# Altium schematic sheet POWER.SchDoc
size A4
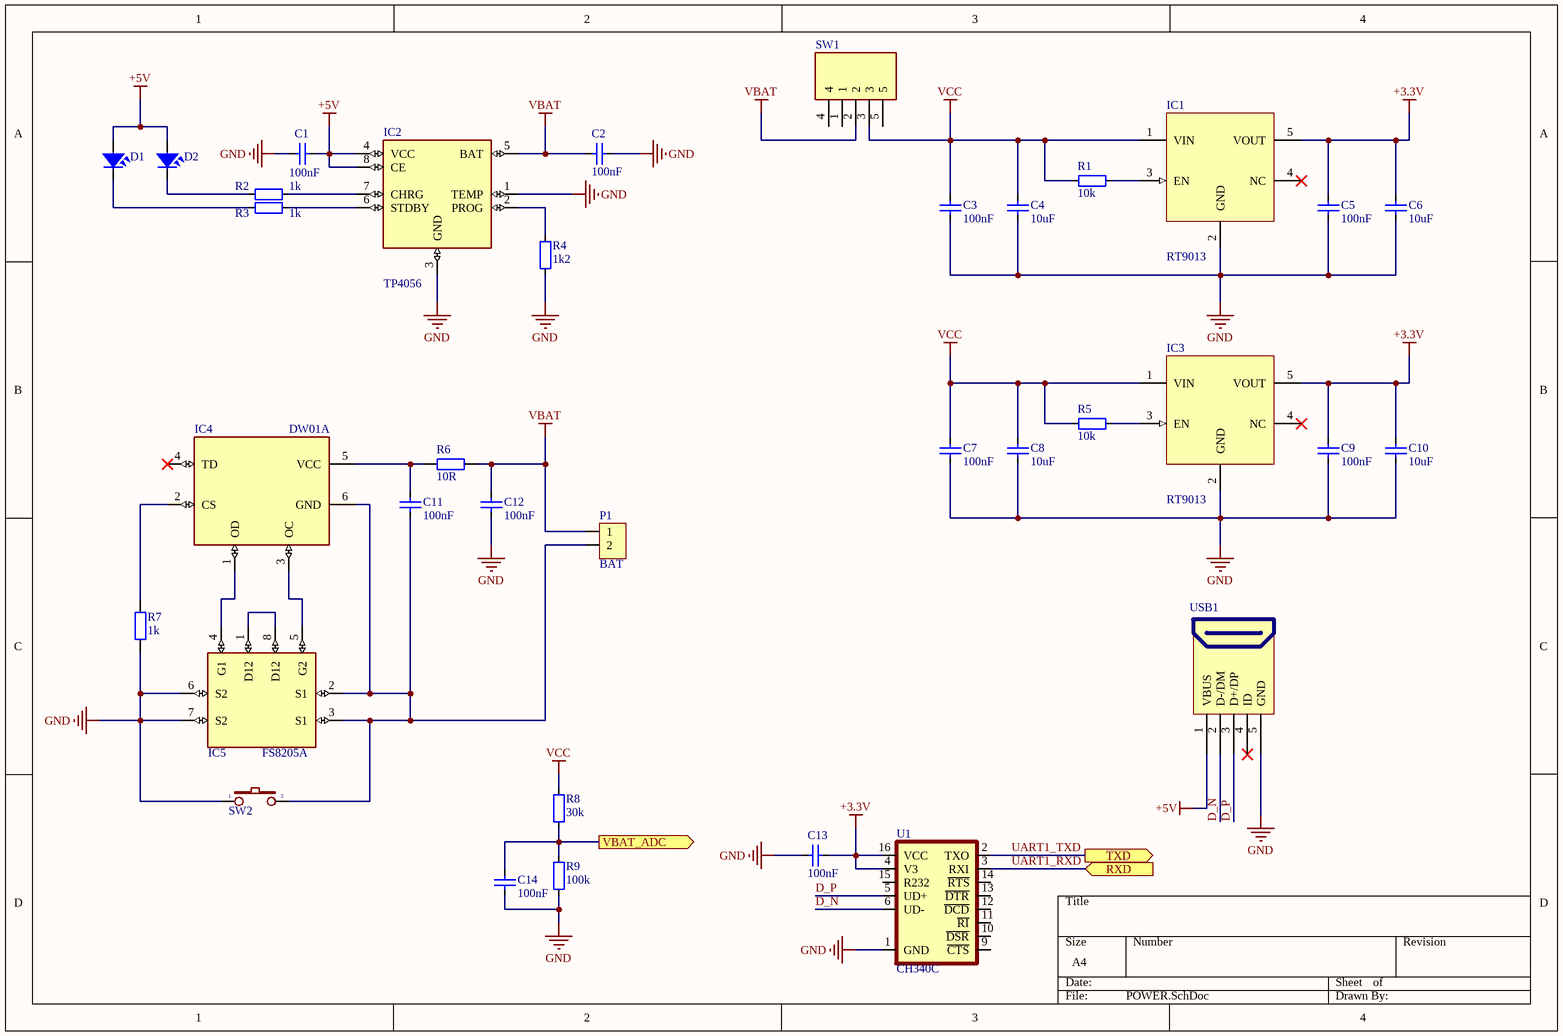
[diagram p0: POWER.SchDoc]

## Parts
C1  100nF  [CAP_0603]
C2  100nF  [CAP_0603]
C3  100nF  [CAP_0603]
C4  10uF  [CAP_0603]
C5  100nF  [CAP_0603]
C6  10uF  [CAP_0603]
C7  100nF  [CAP_0603]
C8  10uF  [CAP_0603]
C9  100nF  [CAP_0603]
C10  10uF  [CAP_0603]
C11  100nF  [CAP_0603]
C12  100nF  [CAP_0603]
C13  100nF  [CAP_0603]
C14  100nF  [CAP_0603]
D1  BLUE  [LED-0603-Green]  (value not drawn)
D2  BLUE  [LED-0603-Green]  (value not drawn)
IC1  RT9013  [SOT23-5]
IC2  TP4056  [TP4056]
IC3  RT9013  [SOT23-5]
IC4  DW01A  [SOT23-6]
IC5  FS8205A  [FS8205A]
P1  BAT  [HEAD2P-1.25]
R1  10k  [RES-SMD-0603]
R2  1k  [RES-SMD-0603]
R3  1k  [RES-SMD-0603]
R4  1k2  [RES-SMD-0603]
R5  10k  [RES-SMD-0603]
R6  10R  [RES-SMD-0603]
R7  1k  [RES-SMD-0603]
R8  30k  [RES-SMD-0603]
R9  100k  [RES-SMD-0603]
SW1  Cong tac gat  [CONG-TAC-GAT]  (value not drawn)
SW2  SW  [SW]  (value not drawn)
U1  CH340C  [SO16]
USB1  USB Micro 5p DIP  [USB Micro 5p DIP]  (value not drawn)

## Ports
RXD (in), TXD (out), VBAT_ADC (out)

## Nets
+3.3V: C5.1 C6.1 C9.1 C10.1 C13.1 IC1.5(VOUT) IC3.5(VOUT) U1.4(V3) U1.16(VCC)
+5V: C1.1 D1.1 D2.1 IC2.4(VCC) IC2.8(CE) USB1.1(VBUS)
GND: C1.2 C2.1 C3.2 C4.2 C5.2 C6.2 C7.2 C8.2 C9.2 C10.2 C12.1 C13.2 C14.1 IC1.2(GND) IC2.1(TEMP) IC2.3(GND) IC3.2(GND) IC5.6(S2) IC5.7(S2) R4.1 R7.2 R9.2 SW2.1 U1.1(GND) USB1.5(GND)
VBAT: C2.2 C12.2 IC2.5(BAT) P1.1 R6.2 SW1.2
VCC: C3.1 C4.1 C7.1 C8.1 IC1.1(VIN) IC3.1(VIN) R1.2 R5.2 R8.1 SW1.3
D_N: U1.6(UD-) USB1.2(D-/DM)
D_P: U1.5(UD+) USB1.3(D+/DP)
UART1_RXD: U1.3(RXI) ; port RXD
UART1_TXD: U1.2(TXO) ; port TXD
VBAT_ADC: C14.2 R8.2 R9.1 ; port VBAT_ADC
NetC11_1: C11.1 IC4.6(GND) IC5.2(S1) IC5.3(S1) P1.2 SW2.2
NetC11_2: C11.2 IC4.5(VCC) R6.1
NetD1_2: D1.2 R3.2
NetD2_2: D2.2 R2.2
NetIC1_3: IC1.3(EN) R1.1
NetIC2_2: IC2.2(PROG) R4.2
NetIC2_6: IC2.6(STDBY) R3.1
NetIC2_7: IC2.7(CHRG) R2.1
NetIC3_3: IC3.3(EN) R5.1
NetIC4_1: IC4.1(OD) IC5.4(G1)
NetIC4_2: IC4.2(CS) R7.1
NetIC4_3: IC4.3(OC) IC5.5(G2)
NetIC5_1: IC5.1(D12) IC5.8(D12)

Not connected (* = marked no-connect by the designer): IC1 4(NC)*; IC3 4(NC)*; IC4 4(TD)*; SW1 1 4 5; U1 9(~{CTS}) 10(~{DSR}) 11(~{RI}) 12(~{DCD}) 13(~{DTR}) 14(~{RTS}) 15(R232); USB1 4(ID)*

## Library data of the parts
C1-C14 = CapSMD: Capacitor; Value: 33p; Published: 8-Jun-2000; LatestRevisionDate: 17-Jul-2002; LatestRevisionNote: Re-released for DXP Platform.; PackageReference: RAD-0.3; Publisher: Altium Limited
D1 D2 = LED: LED Single colour Green and Red; Value: LED 3 ly Single Colour
IC1 IC3 = RT9013: RT9013-33GB IC REG LINEAR 3.3V 500mA SOT23-5
IC2 = TP4056: Complete single cell Li-Ion battery with a constant current / constant voltage linear charger
IC4 = DW01A: One Cell Lithium-ion/Polymer Battery Protection IC
P1 = Header2: Header IDC, 2 x 1 Pin Vertical 2.54mm Pitch (Non-Boxed, Male); Manufacturer: W¨¹rth Elektronik eiSos GmbH; partNo: 613002143121; ComponentLink1 Description: Manufacturer; ComponentLink2 Description: Datasheet; NoPins: 02; Created Date: 29 March 2013; ComponentLink1URL: http://www.we-online.com; ComponentLink2URL: http://katalog.we-online.de/em/datasheet/6130xx143121.pdf; Created by: Karrer Zheng
R1-R5 R8 R9 = Resistor - SMD: Resistor; Manufacturer: Generic Components; Class: Passive; Published: 08/06/2000; Publisher: Altium Hobart Technology Centre
R6 R7 = Resistor - SMD: Resistor SMD; Manufacturer: Generic Components; Class: Passive; Published: 08/06/2000; Publisher: Altium Hobart Technology Centre
U1 = CH340C: USB to serial chip CH340; MF: WCH; Package: Package; Check_prices: https://www.snapeda.com/parts/CH340C/WCH/view-part/5428851/?ref=eda; Value: *; Price: None; MP: CH340C; Availability: Unavailable; SnapEDA_Link: https://www.snapeda.com/parts/CH340C/WCH/view-part/5428851/?ref=snap
USB1 = USB Micro 5p DIP: USB Type B; Ten: MicroUSB MK5P DIP; Ma_Hang: MH005145